# EAGLE schematic ColdRaskroj (EAGLE 7.0.0)
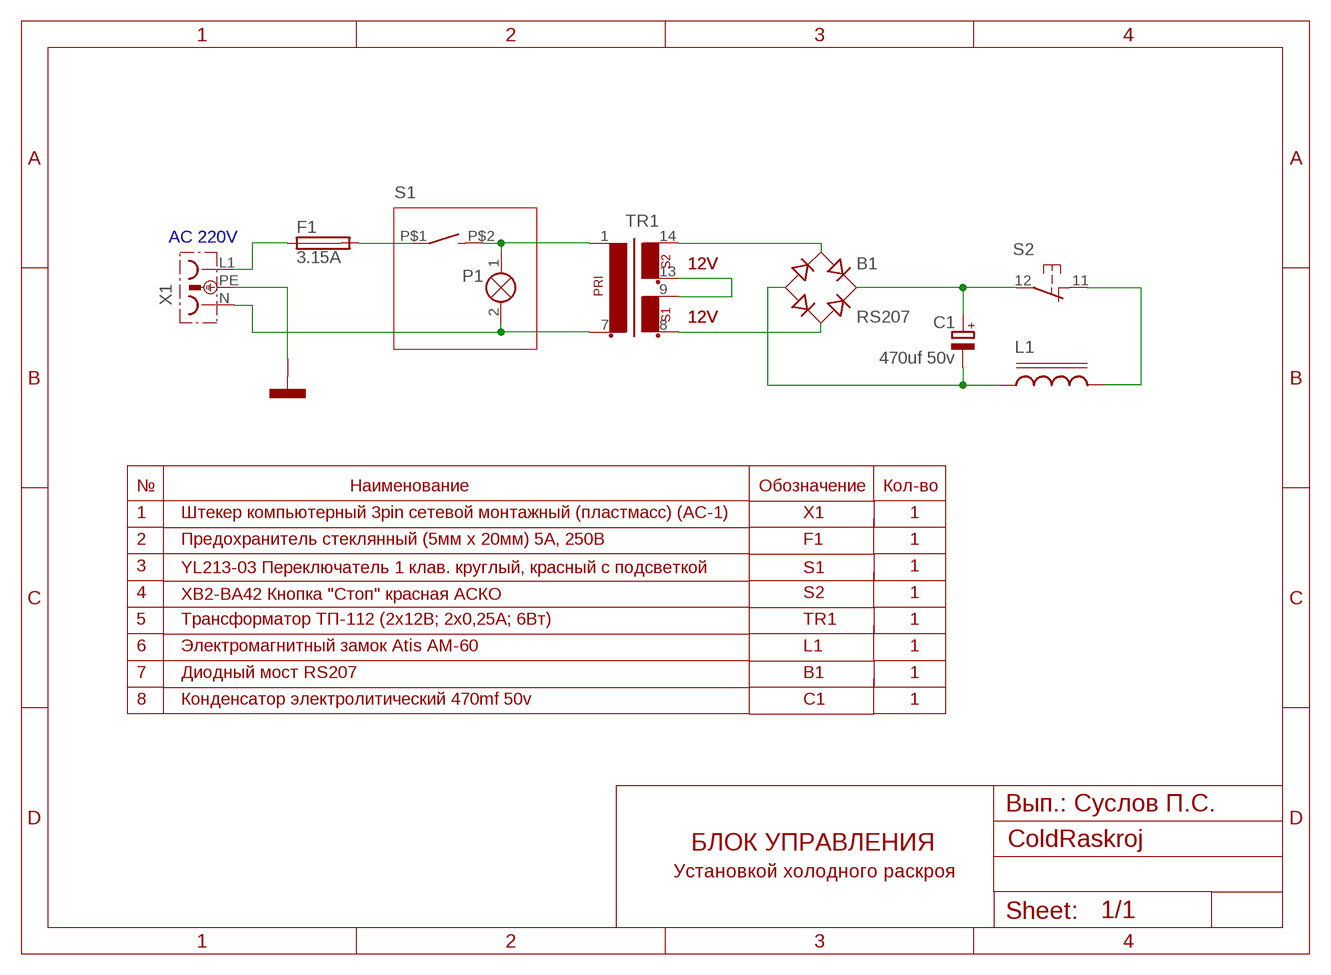
[diagram p0: schematic, sheet 1]

## Parts
B1  RS207  B-DIL  [B-DIL]
C1  470uf 50v  CPOL-EU085CS-1AR  [085CS_1AR]
F1  3.15A  GSH15  [GSH15]
GG  MASSE_ALLGEMEIN  [MASSE_ALLGEMEIN]
L1  L-US0204/5  [0204/5]
P1  SIGNALLAMPE  [LAMPE]
S1  SCHLIESSER_ARBEITSKONTAKT  [1]
S2  OEFFNER_TASTSCHALTER  [OEFFNER_TASTSCHALTER]
TR1  BV054-5387.0K  [EI54-18,8_16VA]
X1  STECKDOSE  [STECKDOSE]

## Nets
N$1: GG.1(0V) X1.PE
N$2: F1.1 X1.L1
N$3: F1.2 S1.P$1
N$4: B1.+ C1.+ S2.12
N$5: P1.1(X1) S1.P$2 TR1.1
N$6: TR1.9 TR1.13
N$7: P1.2(X2) TR1.7 X1.N
N$8: B1.- C1.- L1.1
N$9: L1.2 S2.11
N$13: B1.AC2 TR1.8
N$14: B1.AC1 TR1.14

## Notes on the sheet
- AC 220V
- 12V | 12V
- 12V | 12V
- № | Наименование | Обозначение | Кол-во
- 1 | Штекер компьютерный 3pin сетевой монтажный (пластмасс) (AC-1) | X1 | 1
- 2 | Предохранитель стеклянный (5мм х 20мм) 5А, 250В | F1 | 1
- 3 | YL213-03 Переключатель 1 клав. круглый, красный с подсветкой | S1 | 1
- 4 | XB2-BA42 Кнопка "Стоп" красная АСКО | S2 | 1
- 5 | Трансформатор ТП-112 (2х12В; 2х0,25А; 6Вт) | TR1 | 1
- 6 | Электромагнитный замок Atis AM-60 | L1 | 1
- 7 | Диодный мост RS207 | B1 | 1
- 8 | Конденсатор электролитический 470mf 50v | C1 | 1
- Вып.: Суслов П.С.
- БЛОК УПРАВЛЕНИЯ
- Установкой холодного раскроя

## Library data of the parts
B1 = rectifier:B-DIL: RECTIFIER
C1 = rcl:CPOL-EU: POLARIZED CAPACITOR, European symbol
F1 = fuse:GSH15: FUSE HOLDER grid 15mm, 19649 Wickmann; MPN: 64900001039; OC_FARNELL: 1271673; OC_NEWARK: 02P0318
GG = e-klemmen:MASSE_ALLGEMEIN: Masse allgemein
L1 = rcl:L-US: INDUCTOR, American symbol
P1 = e-lampen-signalisation:SIGNALLAMPE: Lampe
S1 = e-symbole:SCHLIESSER_ARBEITSKONTAKT: Schließer (Arbeitskontakt)
S2 = e-schalter:OEFFNER_TASTSCHALTER: Tastschalter, Öffner
TR1 = trafo:BV054-*: ERA EI 54/18,8 16 VA Source: 207-5567.pdf
X1 = e-steckverbinder:STECKDOSE: Steckdose mit Schutzleiter